# EAGLE design LCD44 (EAGLE 8.0.2)
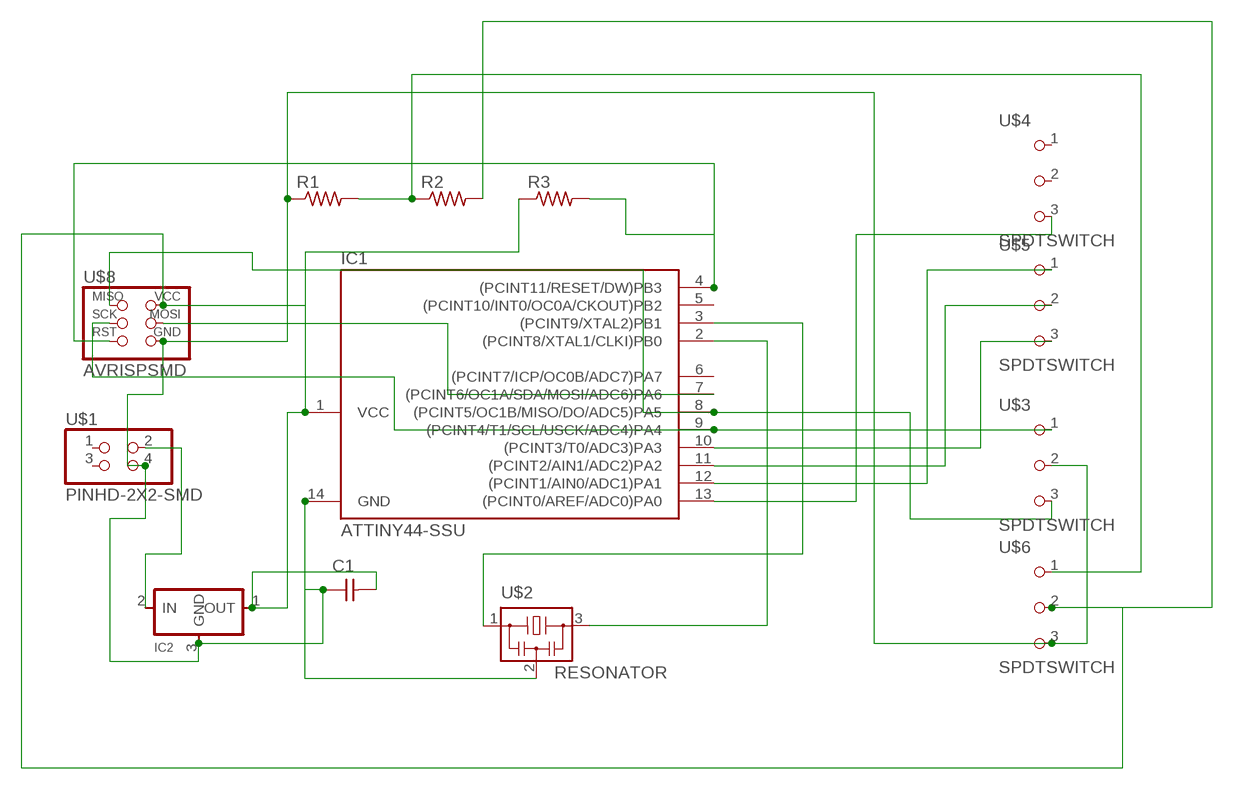
[diagram p0: schematic, sheet 1]

## Parts
C1  CAP-UNPOLARIZEDFAB  [C1206FAB]
IC1  ATTINY44-SSU  [SOIC14]
IC2  REGULATORSOT23  [SOT23]
R1  RES-US1206FAB  [R1206FAB]
R2  RES-US1206FAB  [R1206FAB]
R3  RES-US1206FAB  [R1206FAB]
U$1  PINHD-2X2-SMD  [2X02SMD]
U$2  RESONATOR  [EFOBM]
U$3  SPDTSWITCH  [SPDTSWITCH]
U$4  SPDTSWITCH  [SPDTSWITCH]
U$5  SPDTSWITCH  [SPDTSWITCH]
U$6  SPDTSWITCH  [SPDTSWITCH]
U$8  AVRISPSMD  [2X03SMD]

## Nets
N$1: IC1.4((PCINT11/RESET/DW)PB3) R3.2 U$8.5(RST)
N$2: C1.2 IC1.1(VCC) IC2.1(OUT) R2.2 R3.1 U$6.2 U$8.2(VCC)
N$3: IC1.2((PCINT8/XTAL1/CLKI)PB0) U$2.3
N$4: IC1.3((PCINT9/XTAL2)PB1) U$2.1
N$5: IC1.7((PCINT6/OC1A/SDA/MOSI/ADC6)PA6) U$8.4(MOSI)
N$6: IC2.2(IN) U$1.2
N$7: C1.1 IC1.14(GND) IC2.3(GND) R1.1 U$1.4 U$2.2 U$3.2 U$6.3 U$8.6(GND)
N$8: IC1.9((PCINT4/T1/SCL/USCK/ADC4)PA4) U$3.1 U$8.3(SCK)
N$9: IC1.8((PCINT5/OC1B/MISO/DO/ADC5)PA5) U$3.3 U$8.1(MISO)
N$10: R1.2 R2.1 U$6.1
N$11: IC1.10((PCINT3/T0/ADC3)PA3) U$5.3
N$12: IC1.11((PCINT2/AIN1/ADC2)PA2) U$5.2
N$13: IC1.12((PCINT1/AIN0/ADC1)PA1) U$5.1
N$14: IC1.13((PCINT0/AREF/ADC0)PA0) U$4.3
Unconnected: IC1.5((PCINT10/INT0/OC0A/CKOUT)PB2) IC1.6((PCINT7/ICP/OC0B/ADC7)PA7) U$1.1 U$1.3 U$4.1 U$4.2

## Library data of the parts
C1 = 01_fab:CAP-UNPOLARIZED
IC1 = 01_fab:ATTINY44
IC2 = 01_fab:REGULATOR
R1-R3 = 01_fab:RES-US: Resistor (US Symbol) Variants with postfix FAB are widened to allow the routing of internal traces
U$1 = 01_fab:PINHD-2X2-SMD
U$2 = 01_fab:RESONATOR
U$3-U$6 = 01_fab:SPDTSWITCH
U$8 = 01_fab:AVRISP

## Board
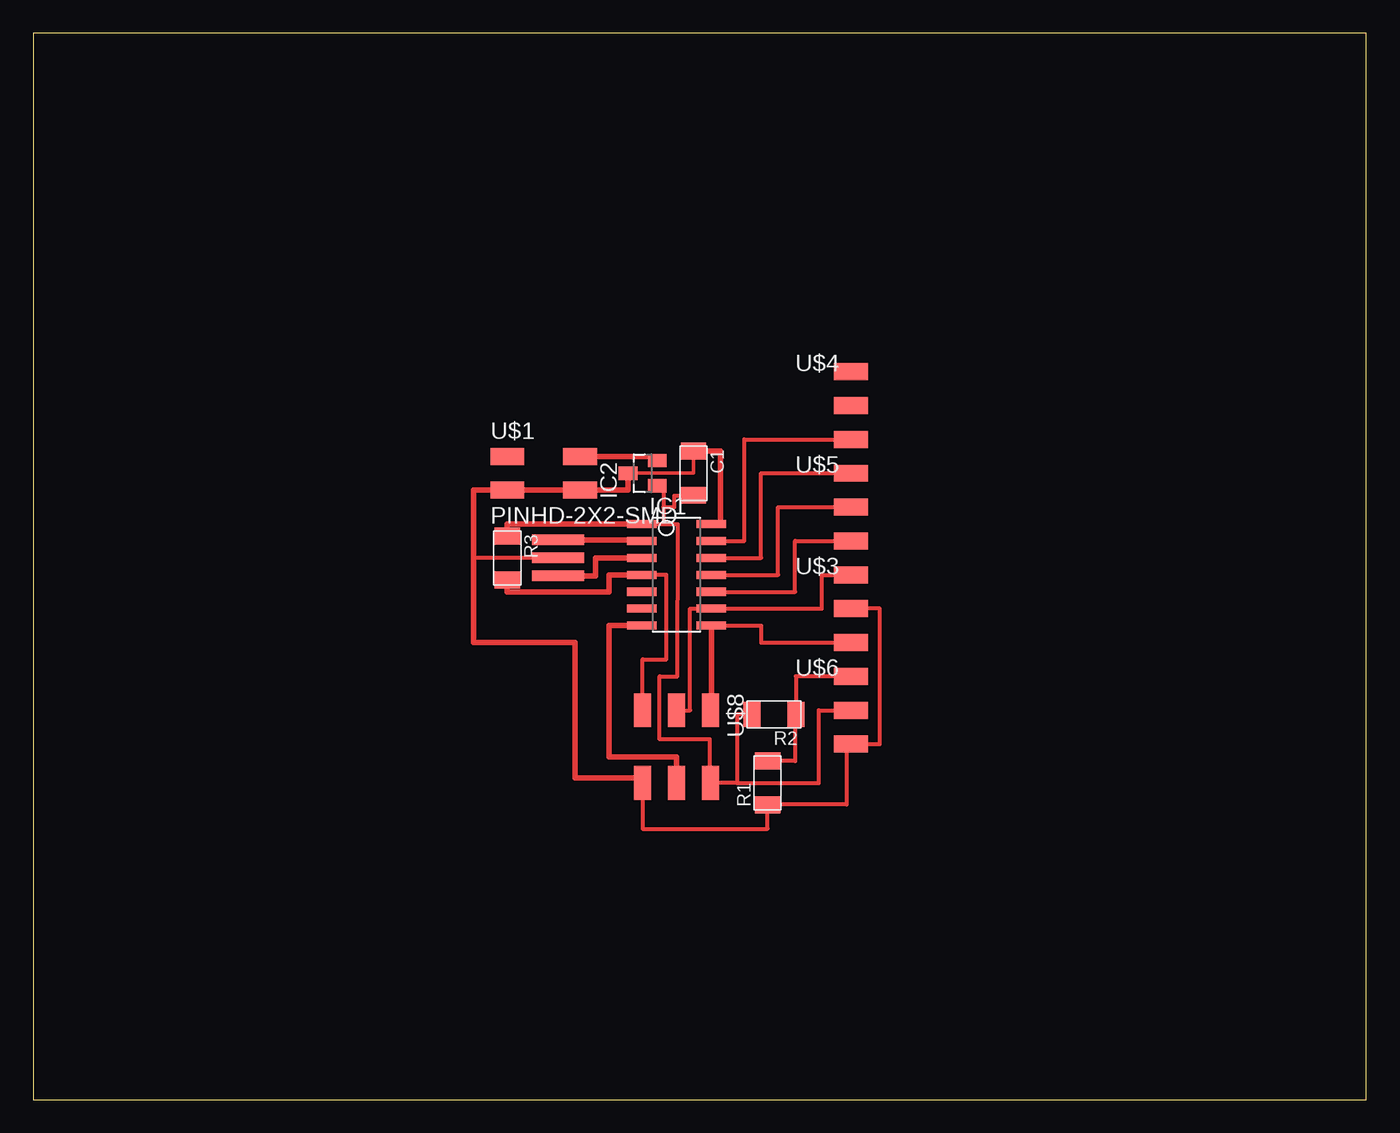
[diagram p1: board, top side]

Size 100 x 80 mm. Coordinates in mm from the lower left corner, seen from the top.
Outline: 0,0 100,0 100,80 0,80 0,0
Copper layers (1*16): Top 0.035mm / dielectric 1.5mm / Bottom 0.035mm
Design rules "default *": minimum track width 10mil, minimum drill 24mil, track to track 12mil, track to pad 12mil, pad to pad 12mil, via to via 12mil, smd to smd 12mil, copper to edge 40mil, drill to drill 8mil, minimum pad ring 10mil, minimum via ring 8mil, stop-mask expansion 4mil, vias tented up to drill 0mil, thermal gap 10mil

### Footprints (pad centres in the part's own frame; a part is rotated, then mirrored left to right if it is on the bottom)
C1206FAB = smd 1.27 x 1.905: 1 -1.651,0; 2 1.651,0
SOIC14 = smd 0.61 x 2.21: 1 -3.81,-2.603; 2 -2.54,-2.603; 3 -1.27,-2.603; 4 0,-2.603; 5 1.27,-2.603; 6 2.54,-2.603; 7 3.81,-2.603; 8 3.81,2.603; 9 2.54,2.603; 10 1.27,2.603; 11 0,2.603; 12 -1.27,2.603; 13 -2.54,2.603; 14 -3.81,2.603
SOT23 = smd 1 x 1.4: 1 -0.95,-1.1; 2 0.95,-1.1; 3 0,1.1
R1206FAB = smd 1.27 x 1.905: 1 -1.651,0; 2 1.651,0
2X02SMD = smd 2.54 x 1.27: 1 -2.54,1.27; 2 2.92,1.27; 3 -2.54,-1.27; 4 2.92,-1.27
EFOBM = smd 0.8 x 3.9: 1 -1.35,0; 2 0,0; 3 1.35,0
SPDTSWITCH = smd 2.54 x 1.27: 1 0.38,2.54; 2 0.38,0; 3 0.38,-2.54
2X03SMD = smd 2.54 x 1.27: 1 -2.54,2.54; 2 2.92,2.54; 3 -2.54,0; 4 2.92,0; 5 -2.54,-2.54; 6 2.92,-2.54

### Placement (x,y rotation side)
C1  49.53,46.99 270 top
IC1  48.26,39.37 270 top
IC2  45.72,46.99 90 top
R1  55.09,23.75 90 top
R2  55.56,28.89 180 top
R3  35.56,40.64 270 top
U$1  38.1,46.99 0 top
U$2  39.37,40.64 90 top
U$3  60.96,36.83 0 top
U$4  60.96,52.07 0 top
U$5  60.96,44.45 0 top
U$6  60.96,29.21 0 top
U$8  48.26,26.67 270 top

### Tracks (layer width: path | path; a pad name or v marks a point on that pad's centre or on a via)
N$1
  Top 0.305: U$8.5 45.72,33.02 47.5,33.02 47.5,39.37 IC1.4
  Top 0.406: IC1.4 43.18,39.37 43.18,38.1 35.56,38.1 R3.2
N$2
  Top 0.305: 49.53,45.37 C1.2 49.53,45.31 48.1,45.31 48.1,44.45 47.28,44.45 | 47.28,43.18 48.35,43.18 48.32,31.75 46.99,31.75 46.99,27.02 50.77,27.02 50.77,23.75 U$8.2 52.8,23.75 | IC1.1 47.28,43.18 | IC2.1 47.28,46.04 47.28,44.45 | 47.28,44.45 47.28,43.18 | 52.8,23.75 58.93,23.75 58.93,29.21 U$6.2 | R2.2 52.8,28.89 52.8,23.75
  Top 0.406: R3.1 35.56,43.18 IC1.1 | 46.99,46.04 IC2.1
N$3
  Top 0.406: U$2.3 45.66,41.99 IC1.2
N$4
  Top 0.406: U$2.1 42.2,39.29 42.2,40.64 IC1.3
N$5
  Top 0.406: U$8.4 48.26,25.72 43.18,25.72 43.18,35.56 IC1.7
N$6
  Top 0.406: U$1.2 46.82,48.26 IC2.2
N$7
  Top 0.254: IC2.3 49.53,46.99 C1.1
  Top 0.305: U$2.2 33.02,40.64 | U$8.6 45.72,20.32 55.09,20.32 R1.1 55.09,22.13 61.02,22.13 61.02,26.67 U$6.3 63.5,26.67 63.5,36.83 U$3.2
  Top 0.406: IC2.3 44.62,45.72 U$1.4 33.02,45.72 33.02,40.64 33.02,34.29 40.64,34.29 40.64,24.13 45.72,24.13 U$8.6 | C1.1 51.56,48.64 51.56,43.18 IC1.14
N$8
  Top 0.305: U$8.3 49.28,29.21 49.28,36.83 IC1.9 59.15,36.83 59.15,39.37 U$3.1
N$9
  Top 0.305: IC1.8 54.61,35.56 54.61,34.29 U$3.3
  Top 0.406: U$8.1 50.86,29.21 IC1.8
N$10
  Top 0.305: U$6.1 57.21,31.75 R2.1 57.15,28.89 57.15,25.4 R1.2
N$11
  Top 0.305: IC1.10 57.15,38.1 57.15,41.91 U$5.3
N$12
  Top 0.305: IC1.11 55.88,39.37 55.88,44.45 U$5.2
N$13
  Top 0.305: IC1.12 54.61,40.64 54.61,46.99 U$5.1
N$14
  Top 0.305: IC1.13 53.34,41.91 53.34,49.53 U$4.3